# Altium schematic sheet Clock_circuit.SchDoc: FMC_ADC
size 420 x 297 mm; Author: G.Kasprowicz; CompanyName: WUT ISE; DrawnBy: G.Kasprowicz; Organization: WUT ISE; Address1: PW ISE; Address2: Nowowiejska 15/19 00-665 Warsaw; Address3: gkasprow@gmail.com; Revision: 2; SheetNumber: -; SheetTotal: -; ModifiedBy: -; CheckedDate: -; Title2: Clock distribution; DivGrp: WUT ISE; Designer: G.Kasprowicz; ModifiedDate: -; ProjectName: Sensor Box
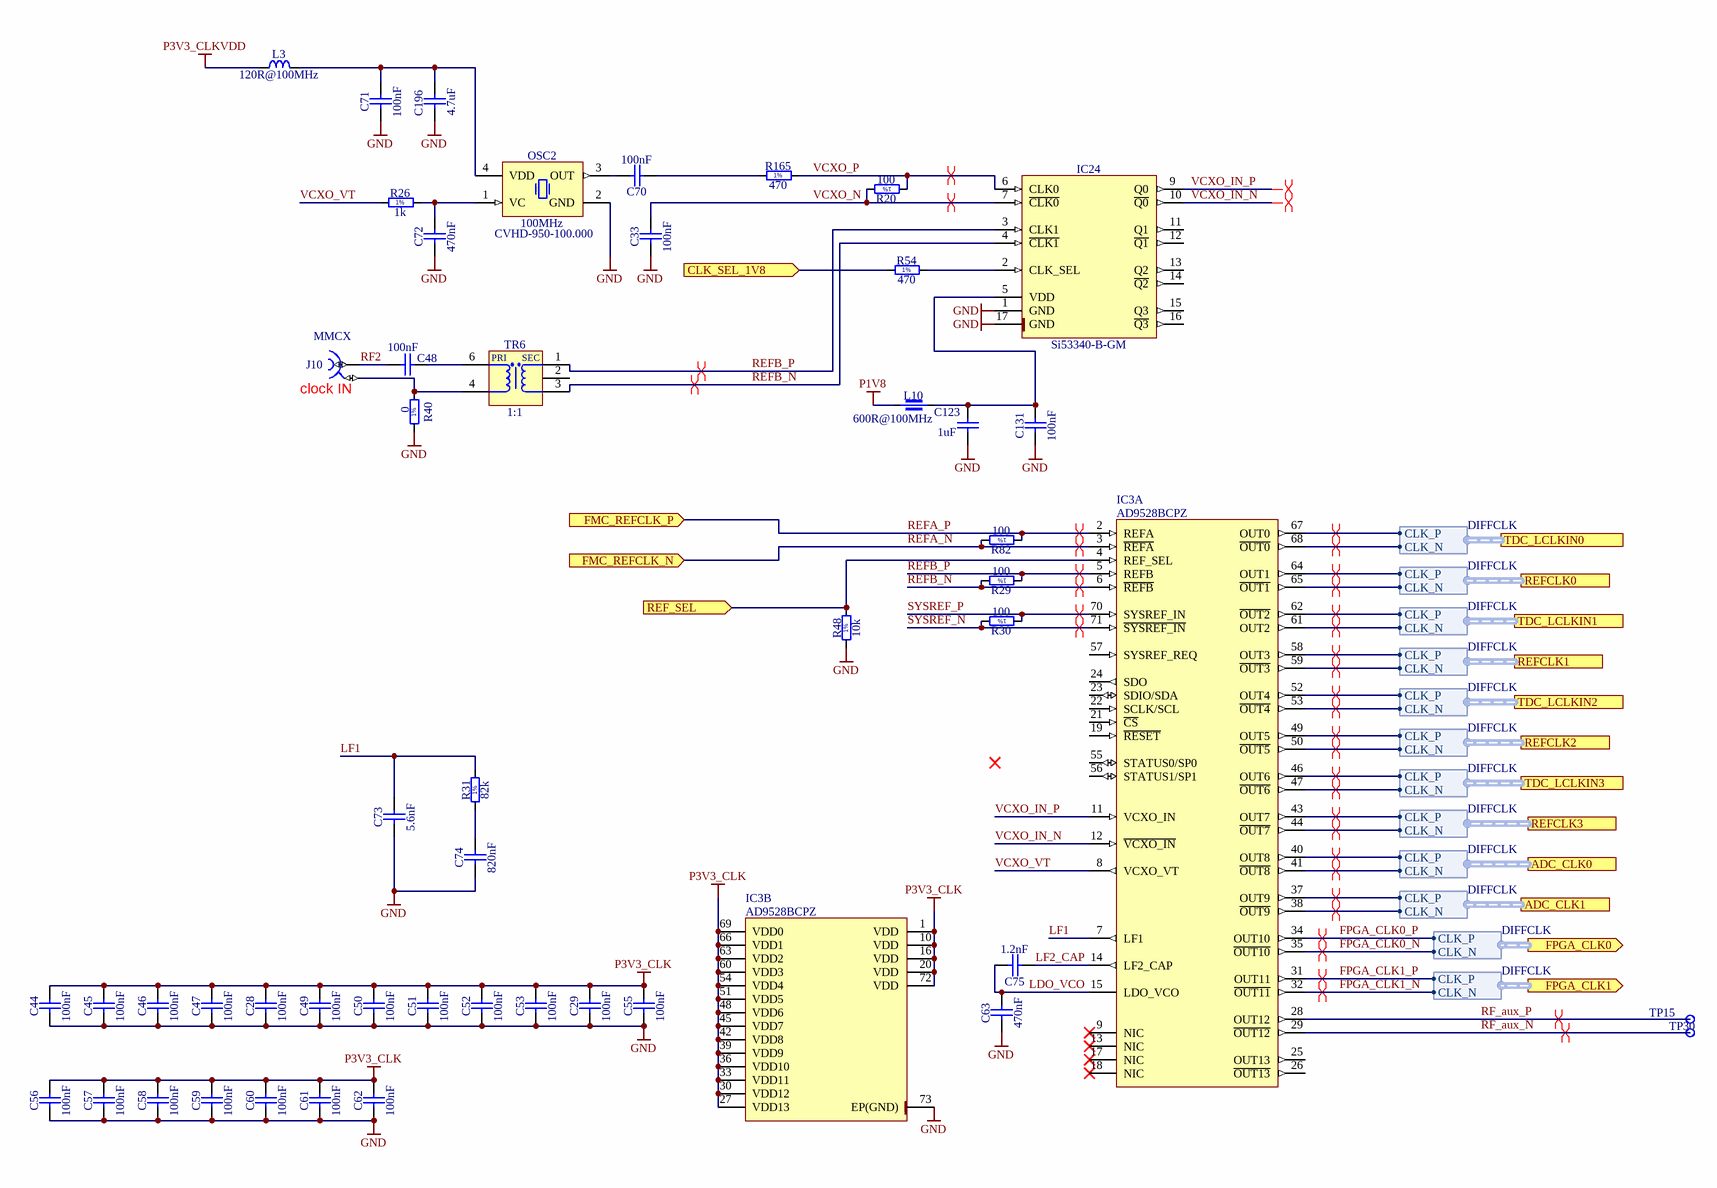
[diagram p0: Clock_circuit.SchDoc]

## Parts
C28  100nF  [CAPC0603X33N]
C29  100nF  [CAPC0603X33N]
C33  100nF  [CAPC0603X33N]
C44  100nF  [CAPC0603X33N]
C45  100nF  [CAPC0603X33N]
C46  100nF  [CAPC0603X33N]
C47  100nF  [CAPC0603X33N]
C48  100nF  [CAPC0603X33N]
C49  100nF  [CAPC0603X33N]
C50  100nF  [CAPC0603X33N]
C51  100nF  [CAPC0603X33N]
C52  100nF  [CAPC0603X33N]
C53  100nF  [CAPC0603X33N]
C55  100nF  [CAPC0603X33N]
C56  100nF  [CAPC0603X33N]
C57  100nF  [CAPC0603X33N]
C58  100nF  [CAPC0603X33N]
C59  100nF  [CAPC0603X33N]
C60  100nF  [CAPC0603X33N]
C61  100nF  [CAPC0603X33N]
C62  100nF  [CAPC0603X33N]
C63  470nF  [CAPC1005X55N]
C70  100nF  [CAPC0603X33N]
C71  100nF  [CAPC0603X33N]
C72  470nF  [CAPC1005X55N]
C73  5.6nF  [CAPC2012X88N]
C74  820nF  [CAPC3216X130N]
C75  1.2nF  [CAPC1608X80N]
C123  1uF  [CAPC1005X55N]
C131  100nF  [CAPC0603X33N]
C196  4.7uF  [CAPC1608X87N]
IC3  AD9528BCPZ  [QFN50P1000X1000X100-73N-S545]  (parts A,B of 2)
IC24  Si53340-B-GM  [QFN50P300X300X90-17N-S175]
J10  Family: MMCX  [HUBER-SUHNER_85_MMCX-50-0-1/111 OH]  (hidden comment: Coax_1Female_1Shield)
L3  120R@100MHz  [INDC1608X65N]
L10  600R@100MHz  [INDC1005X55N]
OSC2  100MHz  Manufacturer Part Number: CVHD-950-100.000  [OSC_CRYSTEK_CVHD-950]
R20  100  [RESC0603X28N]
R26  1k  [RESC1005X40N]
R29  100  [RESC0603X28N]
R30  100  [RESC0603X28N]
R31  82k  [RESC1005X40N]
R40  0  [RESC1005X40N]
R48  10k  [RESC1005X40N]
R54  470  [RESC1005X40N]
R82  100  [RESC0603X28N]
R165  470  [RESC1005X40N]
TP15  Test Point  [TPS62]  (value not drawn)
TP30  Test Point  [TPS62]  (value not drawn)
TR6  1:1  [XFMR_MINI-CIRCUITS_AT224-1]

## Ports
ADC_CLK0 (harness DIFFCLK), ADC_CLK1 (harness DIFFCLK), CLK_SEL_1V8 (in), FMC_REFCLK_N (in), FMC_REFCLK_P (in), FPGA_CLK0 (out, harness DIFFCLK), FPGA_CLK1 (out, harness DIFFCLK), REF_SEL (in), REFCLK0 (harness DIFFCLK), REFCLK1 (harness DIFFCLK), REFCLK2 (harness DIFFCLK), REFCLK3 (harness DIFFCLK), TDC_LCLKIN0 (harness DIFFCLK), TDC_LCLKIN1 (harness DIFFCLK), TDC_LCLKIN2 (harness DIFFCLK), TDC_LCLKIN3 (harness DIFFCLK)

## Harnesses
DIFFCLK: CLK_P, CLK_N

## Nets
GND: C28.1 C29.1 C33.1 C44.1 C45.1 C46.1 C47.1 C49.1 C50.1 C51.1 C52.1 C53.1 C55.1 C56.1 C57.1 C58.1 C59.1 C60.1 C61.1 C62.1 C63.1 C71.1 C72.1 C73.1 C74.1 C123.1 C131.1 C196.1 IC3.73(EP(GND)) IC24.1(GND) IC24.17(GND) OSC2.2(GND) R40.1 R48.1
P1V8: L10.1
P3V3_CLK: C28.2 C29.2 C44.2 C45.2 C46.2 C47.2 C49.2 C50.2 C51.2 C52.2 C53.2 C55.2 C56.2 C57.2 C58.2 C59.2 C60.2 C61.2 C62.2 IC3.1(VDD) IC3.10(VDD) IC3.16(VDD) IC3.20(VDD) IC3.27(VDD13) IC3.30(VDD12) IC3.33(VDD11) IC3.36(VDD10) IC3.39(VDD9) IC3.42(VDD8) IC3.45(VDD7) IC3.48(VDD6) IC3.51(VDD5) IC3.54(VDD4) IC3.60(VDD3) IC3.63(VDD2) IC3.66(VDD1) IC3.69(VDD0) IC3.72(VDD)
P3V3_CLKVDD: L3.1
CLK_SEL_1V8: R54.1 ; port CLK_SEL_1V8
FPGA_CLK0_N: IC3.35(~{OUT10}) ; port FPGA_CLK0.CLK_N
FPGA_CLK0_P: IC3.34(OUT10) ; port FPGA_CLK0.CLK_P
FPGA_CLK1_N: IC3.32(~{OUT11}) ; port FPGA_CLK1.CLK_N
FPGA_CLK1_P: IC3.31(OUT11) ; port FPGA_CLK1.CLK_P
LDO_VCO: C63.2 C75.2 IC3.15(LDO_VCO)
LF1: C73.2 IC3.7(LF1) R31.2
LF2_CAP: C75.1 IC3.14(LF2_CAP)
REF_SEL: IC3.4(REF_SEL) R48.2 ; port REF_SEL
REFA_N: IC3.3(~{REFA}) R82.2 ; port FMC_REFCLK_N
REFA_P: IC3.2(REFA) R82.1 ; port FMC_REFCLK_P
REFB_N: IC3.6(~{REFB}) IC24.4(~{CLK1}) R29.2 TR6.3(S)
REFB_P: IC3.5(REFB) IC24.3(CLK1) R29.1 TR6.1(SDOT)
RF2: C48.2 J10.1
RF_aux_N: IC3.29(~{OUT12}) TP30.1
RF_aux_P: IC3.28(OUT12) TP15.1
SYSREF_N: IC3.71(~{SYSREF_IN}) R30.2
SYSREF_P: IC3.70(SYSREF_IN) R30.1
VCXO_IN_N: IC3.12(~{VCXO_IN}) IC24.10(~{Q0})
VCXO_IN_P: IC3.11(VCXO_IN) IC24.9(Q0)
VCXO_N: C33.2 IC24.7(~{CLK0}) R20.2
VCXO_P: IC24.6(CLK0) R20.1 R165.2
VCXO_VT: IC3.8(VCXO_VT) R26.1
NetC48_1: C48.1 TR6.6(PDOT)
NetC70_1: C70.1 R165.1
NetC70_2: C70.2 OSC2.3(OUT)
NetC71_2: C71.2 C196.2 L3.2 OSC2.4(VDD)
NetC72_2: C72.2 OSC2.1(VC) R26.2
NetC74_2: C74.2 R31.1
NetC123_2: C123.2 C131.2 IC24.5(VDD) L10.2
NetIC3_37: IC3.37(OUT9) ; port ADC_CLK1.CLK_P
NetIC3_38: IC3.38(~{OUT9}) ; port ADC_CLK1.CLK_N
NetIC3_40: IC3.40(OUT8) ; port ADC_CLK0.CLK_P
NetIC3_41: IC3.41(~{OUT8}) ; port ADC_CLK0.CLK_N
NetIC3_43: IC3.43(OUT7) ; port REFCLK3.CLK_P
NetIC3_44: IC3.44(~{OUT7}) ; port REFCLK3.CLK_N
NetIC3_46: IC3.46(OUT6) ; port TDC_LCLKIN3.CLK_P
NetIC3_47: IC3.47(~{OUT6}) ; port TDC_LCLKIN3.CLK_N
NetIC3_49: IC3.49(OUT5) ; port REFCLK2.CLK_P
NetIC3_50: IC3.50(~{OUT5}) ; port REFCLK2.CLK_N
NetIC3_52: IC3.52(OUT4) ; port TDC_LCLKIN2.CLK_P
NetIC3_53: IC3.53(~{OUT4}) ; port TDC_LCLKIN2.CLK_N
NetIC3_58: IC3.58(OUT3) ; port REFCLK1.CLK_P
NetIC3_59: IC3.59(~{OUT3}) ; port REFCLK1.CLK_N
NetIC3_61: IC3.61(OUT2) ; port TDC_LCLKIN1.CLK_N
NetIC3_62: IC3.62(~{OUT2}) ; port TDC_LCLKIN1.CLK_P
NetIC3_64: IC3.64(OUT1) ; port REFCLK0.CLK_P
NetIC3_65: IC3.65(~{OUT1}) ; port REFCLK0.CLK_N
NetIC3_67: IC3.67(OUT0) ; port TDC_LCLKIN0.CLK_P
NetIC3_68: IC3.68(~{OUT0}) ; port TDC_LCLKIN0.CLK_N
NetIC24_2: IC24.2(CLK_SEL) R54.2
NetJ10_2: J10.2 R40.2 TR6.4(P)

Not connected (* = marked no-connect by the designer): IC3 9(NIC)* 13(NIC)* 17(NIC)* 18(NIC)* 19(~{RESET}) 21(~{CS}) 22(SCLK/SCL) 23(SDIO/SDA) 24(SDO) 25(OUT13) 26(~{OUT13}) 55(STATUS0/SP0) 56(STATUS1/SP1) 57(SYSREF_REQ); IC24 11(Q1) 12(~{Q1}) 13(Q2) 14(~{Q2}) 15(Q3) 16(~{Q3}); TR6 2(NU)

## Layout directives
differential pair: FPGA_CLK0_N, FPGA_CLK0_P, FPGA_CLK1_N, FPGA_CLK1_P, NetIC3_37, NetIC3_38, NetIC3_40, NetIC3_41, NetIC3_43, NetIC3_44, NetIC3_46, NetIC3_47, NetIC3_49, NetIC3_50, NetIC3_52, NetIC3_53, NetIC3_58, NetIC3_59, NetIC3_61, NetIC3_62, NetIC3_64, NetIC3_65, NetIC3_67, NetIC3_68, REFA_N, REFA_P, REFB_N, REFB_P, RF_aux_N, RF_aux_P, SYSREF_N, SYSREF_P, VCXO_IN_N, VCXO_IN_P, VCXO_N, VCXO_P

## Notes on the sheet
- (near J10) clock IN
- Project/Equipment
- Document
- Designer
- Drawn by
- Check.by
- Copyright WUT ISE 2018.
  This documentation describes Open Hardware and is licensed under the CERN OHL v.1.1. You may redistribute and modify this documentation under the terms of the CERN OHL v.1.1. (http://ohwr.org/CERNOHL). This documentation is distributed WITHOUT ANY EXPRESS OR IMPLIED WARRANTY, INCLUDING OF MERCHANTABILITY, SATISFACTORY QUALITY AND FITNESS FOR A PARTICULAR PURPOSE. Please see the CERN OHL v.1.1 for applicable conditions.
- Contact
- File
- Last Mod.
- Print Date
- Sheet
- Size
- A3
- of
- Rev
- (in symbol R0201_100R_1%_0.05W_200PPM) 1%
- (in symbol R0402_0R_JUMPER) 1%
- (in symbol R0402_1K_1%_0.0625W_100PPM) 1%
- (in symbol R0402_10K_1%_0.0625W_100PPM) 1%
- (in symbol R0402_82K_1%_0.0625W_100PPM) 1%
- (in symbol R0402_470R_1%_0.0625W_100PPM) 1%
- (in symbol XFMR_MINI-CIRCUITS_TC1-1+) PRI; SEC

## Library data of the parts
C28 C29 C33 C44-C47 C49-C53 C55-C62 C70 C71 = CC0201_100NF_6.3V_10%_X5R: Non-polarised capacitor; Part Description: SMD Multilayer Chip Ceramic Capacitor; Manufacturer: GENERIC; Manufacturer1 Part Number: 02016D104KAT2A; Tolerance: ±10%; Voltage: 6.3V; TC: X5R; Value: 100nF; Part Number: CC0201_100NF_6.3V_10%_X5R; Component Kind: Standard; Component Type: Standard; Pin Count: 2; Status: Not Recommended; Manufacturer Part Number: CC0201_100NF_6.3V_10%_X5R; Case: 0201; Mounted: Yes; Socket: No; SMD: Yes; Sense: No; Manufacturer1 Example: AVX; Manufacturer1 ComponentHeight: 0.33mm; HelpURL: \\cern.ch\dfs\Applications\Altium\Datasheets\CC0201_X5R_AVX.pdf; Author: CERN DEM JLC; CreateDate: 03.12.2007; LatestRevisionDate: 03.12.2007
C48 = CC0201_100NF_6.3V_10%_X5R: Non-polarised capacitor; Part Description: SMD Multilayer Chip Ceramic Capacitor; Manufacturer: GENERIC; Manufacturer1 Part Number: 02016D104KAT2A; Voltage: 6.3V; TC: X5R; Tolerance: ±10%; Table: Capacitors SMD; Part Number: CC0201_100NF_6.3V_10%_X5R; Component Kind: Standard; Component Type: Standard; Pin Count: 2; Value: 100nF; Status: Not Recommended; Manufacturer Part Number: CC0201_100NF_6.3V_10%_X5R; Case: 0201; Mounted: Yes; Socket: No; SMD: Yes; Manufacturer1 Example: AVX; Manufacturer1 ComponentHeight: 0.33mm; HelpURL: \\cern.ch\dfs\Applications\Altium\Datasheets\CC0201_X5R_AVX.pdf; Author: CERN DEM JLC; CreateDate: 2007-12-03; LatestRevisionDate: 2007-12-03
C63 C72 = CC0402_470NF_6.3V_10%_X5R: Non-polarised capacitor; Part Description: SMD Multilayer Chip Ceramic Capacitor; Manufacturer: GENERIC; Manufacturer1 Part Number: GRM155R60J474KE19D; Tolerance: ±10%; Voltage: 6.3V; TC: X5R; Value: 470nF; Part Number: CC0402_470NF_6.3V_10%_X5R; Component Kind: Standard; Component Type: Standard; Pin Count: 2; Status: Preferred; Manufacturer Part Number: CC0402_470NF_6.3V_10%_X5R; Case: 0402; Mounted: Yes; Socket: No; SMD: Yes; Sense: No; Manufacturer1 Example: MURATA; Manufacturer1 ComponentHeight: 0.55mm; HelpURL: \\cern.ch\dfs\Applications\Altium\Datasheets\CC0402_X5R_MURATA_GRM.pdf; Author: CERN DEM JLC; CreateDate: 22.04.2010; LatestRevisionDate: 22.04.2010
C73 = CC0805_5.6NF_50V_5%_C0G: Non-polarised capacitor; Part Description: SMD Multilayer Chip Ceramic Capacitor; Manufacturer: GENERIC; Manufacturer1 Part Number: GRM2195C1H562JA01D; Voltage: 50V; TC: C0G/NP0; Tolerance: ±5%; Part Number: CC0805_5.6NF_50V_5%_C0G; Component Kind: Standard; Component Type: Standard; Pin Count: 2; Value: 5.6nF; Status: Preferred; Manufacturer Part Number: CC0805_5.6NF_50V_5%_C0G; Case: 0805; Mounted: Yes; Socket: No; SMD: Yes; Sense: No; Manufacturer1 Example: Murata; Manufacturer1 ComponentHeight: 0.85mm; Author: *
C74 = CC1206_820NF_25V_10%_X7R: Non-polarised capacitor; Part Description: SMD Multilayer Chip Ceramic Capacitor; Manufacturer: GENERIC; Manufacturer1 Part Number: 12063C824KAT2A; Voltage: 25V; TC: X7R; Tolerance: ±10%; Part Number: CC1206_820NF_25V_10%_X7R; Component Kind: Standard; Component Type: Standard; Pin Count: 2; Value: 820nF; Manufacturer Part Number: CC1206_820NF_25V_10%_X7R; Case: 1206; Mounted: Yes; Socket: No; SMD: Yes; Sense: No; Manufacturer1 ComponentHeight: 1.25mm; Manufacturer1 Example: AVX
C75 = CC0603_1.2NF_50V_5%_C0G: Non-polarised capacitor; Part Description: SMD Multilayer Chip Ceramic Capacitor; Manufacturer: GENERIC; Manufacturer1 Part Number: C0603C122J5GACTU; Tolerance: ±5%; Voltage: 50V; TC: C0G/NP0; Value: 1.2nF; Part Number: CC0603_1.2NF_50V_5%_C0G; Component Kind: Standard; Component Type: Standard; Pin Count: 2; Status: Preferred; Manufacturer Part Number: CC0603_1.2NF_50V_5%_C0G; Case: 0603; Mounted: Yes; Socket: No; SMD: Yes; Sense: No; Manufacturer1 Example: KEMET; Manufacturer1 ComponentHeight: 0.8mm; Author: *
C123 = CC0402_1UF_16V_10%_X5R: Non-polarised capacitor; Part Description: SMD Multilayer Chip Ceramic Capacitor; Manufacturer: GENERIC; Manufacturer1 Part Number: C1005X5R1C105KT; Voltage: 16V; TC: X5R; Tolerance: ±10%; Part Number: CC0402_1UF_16V_10%_X5R; Component Kind: Standard; Component Type: Standard; Pin Count: 2; Value: 1uF; Status: Preferred; Manufacturer Part Number: CC0402_1UF_16V_10%_X5R; Case: 0402; Mounted: Yes; Socket: No; SMD: Yes; Sense: No; Manufacturer1 Example: TDK; Manufacturer1 ComponentHeight: 0.55mm; HelpURL: \\cern.ch\dfs\Applications\Altium\Datasheets\CC0402_X5R_TDK_C.pdf; Author: CERN DEM JLC; CreateDate: 2012-10-25; LatestRevisionDate: 2012-10-25
C131 = CC0201_100NF_6.3V_10%_X5R: Non-polarised capacitor; Part Description: SMD Multilayer Chip Ceramic Capacitor; Manufacturer: GENERIC; Manufacturer1 Part Number: 02016D104KAT2A; Voltage: 6.3V; TC: X5R; Tolerance: ±10%; Part Number: CC0201_100NF_6.3V_10%_X5R; Component Kind: Standard; Component Type: Standard; Pin Count: 2; Value: 100nF; Status: Not Recommended; Manufacturer Part Number: CC0201_100NF_6.3V_10%_X5R; Case: 0201; Mounted: Yes; Socket: No; SMD: Yes; Sense: No; Manufacturer1 Example: AVX; Manufacturer1 ComponentHeight: 0.33mm; HelpURL: \\cern.ch\dfs\Applications\Altium\Datasheets\CC0201_X5R_AVX.pdf; Author: CERN DEM JLC; CreateDate: 03.12.2007; LatestRevisionDate: 03.12.2007
C196 = CC0603_4.7UF_6.3V_10%_X5R: Non-polarised capacitor; Part Description: SMD Multilayer Chip Ceramic Capacitor; Manufacturer: GENERIC; Manufacturer1 Part Number: 225520613672; Voltage: 6.3V; TC: X5R; Tolerance: ±10%; Part Number: CC0603_4.7UF_6.3V_10%_X5R; Component Kind: Standard; Component Type: Standard; Pin Count: 2; Value: 4.7uF; Status: Preferred; Manufacturer Part Number: CC0603_4.7uF_6.3V_10%_X5R; Case: 0603; Mounted: Yes; Socket: No; SMD: Yes; Manufacturer1 Example: PHYCOMP; Manufacturer1 ComponentHeight: 0.87mm; HelpURL: \\cern.ch\dfs\Applications\Altium\Datasheets\CC0805_X5R_PHYCOMP_HC.pdf; Author: CERN DEM JLC; CreateDate: 03.12.2007; LatestRevisionDate: 03.12.2007; Sense: No
IC3 = AD9528BCPZ: Clock Generator with 14 LVDS/HSTL Outputs; Manufacturer: ANALOG DEVICES; PressFit: No; Bonding: No; Part Number: AD9528BCPZ; Component Kind: Standard; Component Type: Standard; Device: AD9528BCPZ; PackageDescription: QFN,0.50mm Pitch, Square;72 Pin,10.00mm L X 10.00mm W X 1.00mm H Body (W/Thermal Tab 5.45mm X 5.45mm), IPC Medium Density; Part Description: Clock Generator with 14 LVDS/HSTL Outputs; Manufacturer Part Number: AD9528BCPZ; Pin Count: 73; Case: QFN72; Mounted: Yes; Socket: No; SMD: Yes; Sense: No; ComponentHeight: 1mm; HelpURL: \\cern.ch\dfs\Applications\Altium\Datasheets\AD9528BCPZ.pdf; Author: CERN DEM JLC; CreateDate: 11.10.2016; LatestRevisionDate: 11.10.2016
IC24 = Si53340-B-GM: Low-Jitter LVDS Fanout Clock Buffers, 10-Output,  Any-Input, Any-Frequency up to 1250MHz; Manufacturer: SILICON LABS; PressFit: No; Bonding: No; Part Number: Si53340-B-GM; Component Kind: Standard; Component Type: Standard; Device: Si53340-B-GM; PackageDescription: QFN, 0.50mm Pitch, Square; 16 Pin, 3.00mm L X 3.00mm W X 0.90mm H Body (w/thermal tab 1.75mm x 1.75mm), IPC Medium Density; Part Description: Low-Jitter LVDS Fanout Clock Buffers, 10-Output,  Any-Input, Any-Frequency up to 1250MHz; Manufacturer Part Number: Si53340-B-GM; Pin Count: 17; Case: QFN16; Mounted: Yes; Socket: No; SMD: Yes; Sense: No; ComponentHeight: 0.9mm; HelpURL: \\cern.ch\dfs\Applications\Altium\Datasheets\Si53340-B-GM.pdf; Author: CERN DEM MR; CreateDate: 04.09.2017; LatestRevisionDate: 04.09.2017
J10 = HUBER-SUHNER_85_MMCX-50-0-1/111 OH: Part Description: MMCX 50 Ohms Right Angle PCB Jack; Manufacturer: HUBER+SUHNER; Table: Miscellaneous; Part Number: HUBER-SUHNER_85_MMCX-50-0-1/111 OH; Component Kind: Standard; Component Type: Standard; Pin Count: 2; Mounted: Yes; Socket: No; SMD: No; Status: None; Manufacturer Part Number: 85_MMCX-50-0-1/111 OH; ComponentHeight: 9.6mm; HelpURL: \\cern.ch\dfs\Applications\Altium\Datasheets\HUBER-SUHNER_85_MMCX-50-0-1-111 OH.pdf; Author: CERN DEM JLC; CreateDate: 2011-10-04; LatestRevisionDate: 2011-10-04
L3 = IND0603_MURATA_BLM18SG121TN1D: Inductor; Part Description: SMD EMIFIL Suppression Chip Ferrite Bead; Manufacturer: MURATA; Power: 3A; Resistance: 0.025R; Tolerance: ±25%; Part Number: IND0603_MURATA_BLM18SG121TN1D; Component Kind: Standard; Component Type: Standard; Pin Count: 2; Value: 120R@100MHz; Status: None; Manufacturer Part Number: BLM18SG121TN1D; Case: 0603; Mounted: Yes; Socket: No; SMD: Yes; Sense: No; ComponentHeight: 0.65mm; HelpURL: \\cern.ch\dfs\Applications\Altium\Datasheets\IND0603_MURATA_BLM18S.pdf; Author: CERN DEM JLC; CreateDate: 23.07.2014; LatestRevisionDate: 23.07.2014
L10 = IND0402_MURATA_BLM15HD601SN1: Part Description: SMD EMIFIL Suppression Chip Ferrite Bead; Manufacturer: MURATA; Manufacturer Part Number: BLM15HD601SN1D; Power: 300mA; Resistance: 0.85R; Tolerance: ±25%; Part Number: IND0402_MURATA_BLM15HD601SN1; Component Kind: Standard; Component Type: Standard; Pin Count: 2; Value: 600R@100MHz; Status: None; Case: 0402; Mounted: Yes; Socket: No; SMD: Yes; Sense: No; ComponentHeight: 0.55mm; HelpURL: \\cern.ch\dfs\Applications\Altium\Datasheets\IND0402_MURATA_BLM15H.pdf; Author: CERN DEM JLC; CreateDate: 28.02.2012; LatestRevisionDate: 25.10.2018
OSC2 = OSC_125MHZ_CRYSTEK_CVHD-950-100.000: Oscillator 4 pins 1=VC 2=GND 3=OUT 4=VDD; Part Description: 3.3V, ±20ppm, 15pF, 0..70°C, CMOS Surface Mount Ultra-Low Noise Oscillator (CVHD-950 Series); Manufacturer: CRYSTEK CRYSTAL; PressFit: No; Bonding: No; Part Number: OSC_125MHZ_CRYSTEK_CVHD-950-100.000; Component Kind: Standard; Component Type: Standard; PackageDescription: Oscillator, 5.08mm Pitch; 4 Pin, 14.2mm L X 9.14mm W X 5.3mm H, CVHD-950 Serie; Value: 100MHz; Pin Count: 4; Mounted: Yes; Socket: No; SMD: Yes; ComponentHeight: 5.3mm; HelpURL: \\cern.ch\dfs\Applications\Altium\Datasheets\OSC_CRYSTEK_CVHD-950.pdf; Author: CERN DEM JLC; CreateDate: 09.10.2012; LatestRevisionDate: 09.10.2012; Sense: No
R20 R29 R30 R82 = R0201_100R_1%_0.05W_200PPM: Resistor - 1%; Part Description: Thick Film Chip Resistor; Manufacturer: GENERIC; Manufacturer1 Part Number: CRCW0201100RFNED; Power: 0.05W; TC: ±200ppm/°C; PressFit: No; Part Number: R0201_100R_1%_0.05W_200PPM; Component Kind: Standard; Component Type: Standard; Pin Count: 2; Value: 100; Status: Not Recommended; Tolerance: ±1%; Manufacturer Part Number: R0201_100R_1%_0.05W_200PPM; Case: 0201; Mounted: Yes; Socket: No; SMD: Yes; Manufacturer1 Example: VISHAY; Manufacturer1 ComponentHeight: 0.27mm; HelpURL: \\cern.ch\dfs\Applications\Altium\Datasheets\R0201_VISHAY_CRCW0201 e3.pdf; Author: CERN DEM JLC; CreateDate: 13.11.2014; LatestRevisionDate: 13.11.2014; Sense: No
R26 = R0402_1K_1%_0.0625W_100PPM: Resistor - 1%; Part Description: General Purpose Thick Film Chip Resistor; Manufacturer: GENERIC; Manufacturer1 Part Number: 232270671002L; TC: ±100ppm/°C; Tolerance: ±1%; Value: 1k; Power: 0.0625W; Part Number: R0402_1K_1%_0.0625W_100PPM; Component Kind: Standard; Component Type: Standard; Pin Count: 2; Status: Not recommended; Manufacturer Part Number: R0402_1K_1%_0.0625W_100PPM; Case: 0402; Mounted: Yes; Sense: No; Socket: No; SMD: Yes; Manufacturer1 Example: YAGEO PHYCOMP; Manufacturer1 ComponentHeight: 0.4mm; HelpURL: \\cern.ch\dfs\Applications\Altium\Datasheets\R0402_Phycomp_RC0402.pdf; Author: CERN DEM JLC; CreateDate: 03.12.2007; LatestRevisionDate: 17.10.2012
R31 = R0402_82K_1%_0.0625W_100PPM: Resistor - 1%; Part Description: General Purpose Thick Film Chip Resistor; Manufacturer: GENERIC; Manufacturer1 Part Number: 232270678203L; TC: ±100ppm/°C; Value: 82k; Tolerance: ±1%; Power: 0.0625W; Part Number: R0402_82K_1%_0.0625W_100PPM; Component Kind: Standard; Component Type: Standard; Pin Count: 2; Status: Not recommended; Manufacturer Part Number: R0402_82K_1%_0.0625W_100PPM; Case: 0402; Mounted: Yes; Sense: No; Socket: No; SMD: Yes; Manufacturer1 Example: YAGEO PHYCOMP; Manufacturer1 ComponentHeight: 0.4mm; HelpURL: \\cern.ch\dfs\Applications\Altium\Datasheets\R0402_Phycomp_RC0402.pdf; Author: CERN DEM JLC; CreateDate: 03.12.2007; LatestRevisionDate: 17.10.2012
R40 = R0402_0R_JUMPER: Resistor - 1%; Part Description: 1A (0.05R Max DC Resistance) Zero Ohm Jumper; Manufacturer: GENERIC; Manufacturer1 Part Number: 232270591001L; Table: Resistors SMD; Part Number: R0402_0R_JUMPER; Component Kind: Standard; Component Type: Standard; Pin Count: 2; Value: 0; Status: Not recommended; Manufacturer Part Number: R0402_0R_JUMPER; Case: 0402; Mounted: Yes; Socket: No; SMD: Yes; Manufacturer1 Example: YAGEO PHYCOMP; Manufacturer1 ComponentHeight: 0.4mm; HelpURL: \\cern.ch\dfs\Applications\Altium\Datasheets\R0402_Phycomp_RC0402.pdf; Author: CERN DEM JLC; CreateDate: 3/12/2007; LatestRevisionDate: 17/10/2012
R48 = R0402_10K_1%_0.0625W_100PPM: Resistor - 1%; Part Description: General Purpose Thick Film Chip Resistor; Manufacturer: GENERIC; Manufacturer1 Part Number: 232270671003L; TC: ±100ppm/°C; Table: Resistors SMD; Part Number: R0402_10K_1%_0.0625W_100PPM; Component Kind: Standard; Component Type: Standard; Pin Count: 2; Value: 10k; Status: Not recommended; Power: 0.0625W; Tolerance: ±1%; Manufacturer Part Number: R0402_10K_1%_0.0625W_100PPM; Case: 0402; Mounted: Yes; Socket: No; SMD: Yes; Manufacturer1 Example: YAGEO PHYCOMP; Manufacturer1 ComponentHeight: 0.4mm; HelpURL: \\cern.ch\dfs\Applications\Altium\Datasheets\R0402_Phycomp_RC0402.pdf; Author: CERN DEM JLC; CreateDate: 3/12/2007; LatestRevisionDate: 17/10/2012
R54 R165 = R0402_470R_1%_0.0625W_100PPM: Resistor - 1%; Part Description: General Purpose Thick Film Chip Resistor; Manufacturer: GENERIC; Manufacturer1 Part Number: 232270674701L; TC: ±100ppm/°C; PressFit: No; Part Number: R0402_470R_1%_0.0625W_100PPM; Component Kind: Standard; Component Type: Standard; Pin Count: 2; Value: 470; Status: Not Recommended; Power: 0.0625W; Tolerance: ±1%; Manufacturer Part Number: R0402_470R_1%_0.0625W_100PPM; Case: 0402; Mounted: Yes; Sense: No; Socket: No; SMD: Yes; Manufacturer1 Example: YAGEO PHYCOMP; Manufacturer1 ComponentHeight: 0.4mm; HelpURL: \\cern.ch\dfs\Applications\Altium\Datasheets\R0402_Phycomp_RC0402.pdf; Author: CERN DEM JLC; CreateDate: 03.12.2007; LatestRevisionDate: 17.10.2012
TP15 TP30 = SMD_PAD_0.62X0.62MM: Part Description: 0.62mm x 0.62mm PCB Copper Area (SMD Test Point); Mounted: No; Part Number: SMD_PAD_0.62X0.62MM; Component Kind: Standard (No BOM); Component Type: Standard (No BOM); Pin Count: 1; Family: Test Point; Socket: No; SMD: Yes; Sense: No; Status: None; ComponentHeight: 0mm; HelpURL: Undefined; Author: CERN DEM JLC; CreateDate: 12.01.2008; LatestRevisionDate: 12.01.2008; PackageDescription: 0.62mm x 0.62mm PCB Copper Area (SMD Test Point)
TR6 = XFMR_MINI-CIRCUITS_TC1-1+: 50 Ohm  0.4 To 500MHz RF Transformers; Part Number: XFMR_MINI-CIRCUITS_TC1-1T+; Part Description: 50 Ohms 1.5 to 500 MHz RF Transformer; Manufacturer Part Number: TC1-1T+; Component Kind: Standard; Component Type: Standard; Pin Count: 5; Value: 1:1; Status: None; Manufacturer: MINI-CIRCUITS; Mounted: Yes; Socket: No; SMD: Yes; ComponentHeight: 4.06mm; HelpURL: \\cern.ch\dfs\Applications\Altium\Datasheets\XFMR_MINI-CIRCUITS_TC1-1+.pdf; Author: CERN DEM JLC; CreateDate: 2010-02-08; LatestRevisionDate: 2010-04-27; Table: Transformers